# Altium schematic sheet 004_I2C Usage Diagram.SchDoc
size 420 x 297 mm; Page Create Date: May 29, 2006; WebSite: https://www.seeedstudio.com; Page Number: 4; Drawing: qxn; Schematic Name: BeaglePlay; Page Size: A3; Comment: Seeed Title; Page Count: 22; Page Name: 004_I2C Usage Diagram; Company: Seeed Studio; RevCode: v0.2; DsnPath: C:\Users\a0488739\Documents\GitHub\beagleplay\allegro\DVT\BEAGLEPLAYV020_220915.DSN; SchematicName: BeaglePlay; PageName: 004_I2C Usage Diagram; PageSize: A3; TopSchematic: True
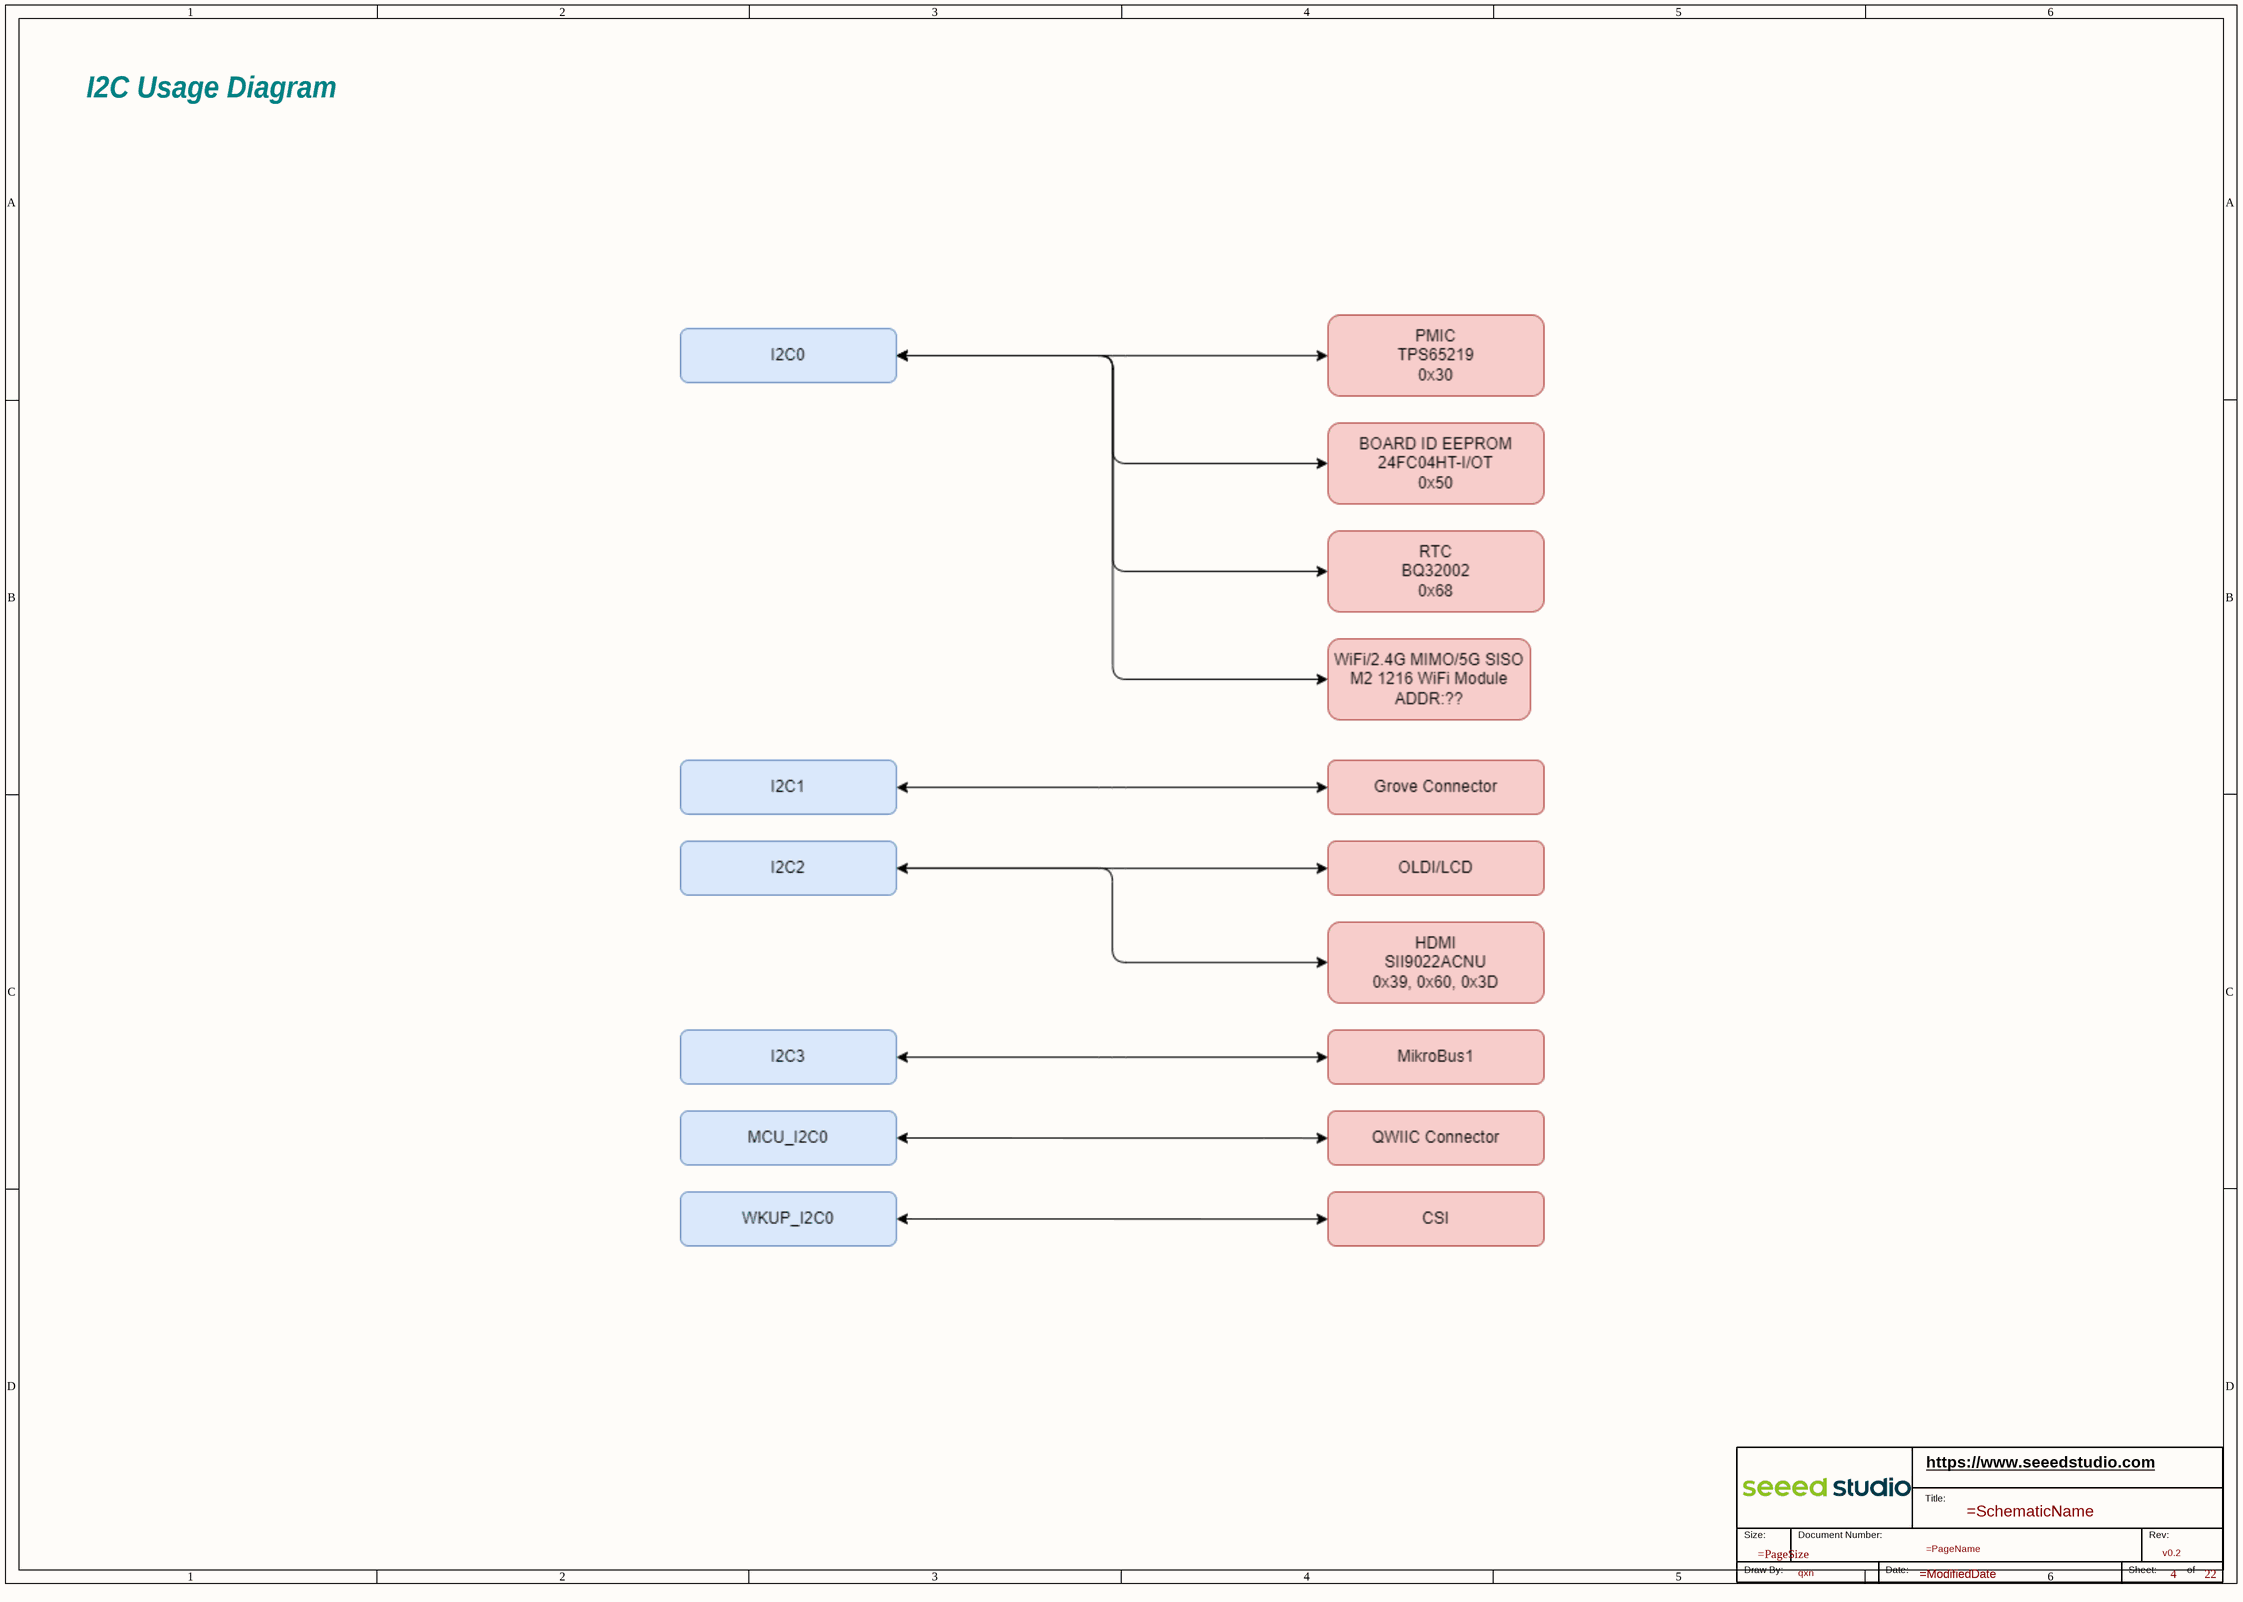
[diagram p0: 004_I2C Usage Diagram.SchDoc]

## Parts
*  RevCode: v0.2  Page Number: 4  Page Count: 22  Drawing: qxn  (hidden comment: Seeed Title)  (graphical)

## Notes on the sheet
- I2C Usage Diagram
- (in symbol Seeed Title) https://www.seeedstudio.com; Title:; Size:; Document Number:; Rev:; Draw By:; Date:; Sheet:; of

## Library data of the parts
* = Seeed Title: Company: Seeed Studio; WebSite: https://www.seeedstudio.com; Schematic Name: =SchematicName; Page Size: =PageSize; Page Name: =PageName; Page Create Date: May 29, 2006; Page Modify Date: =ModifiedDate